# Altium schematic sheet DIGITAL_INPUTS.SchDoc
size A3; SheetNumber: 7; SheetTotal: 14
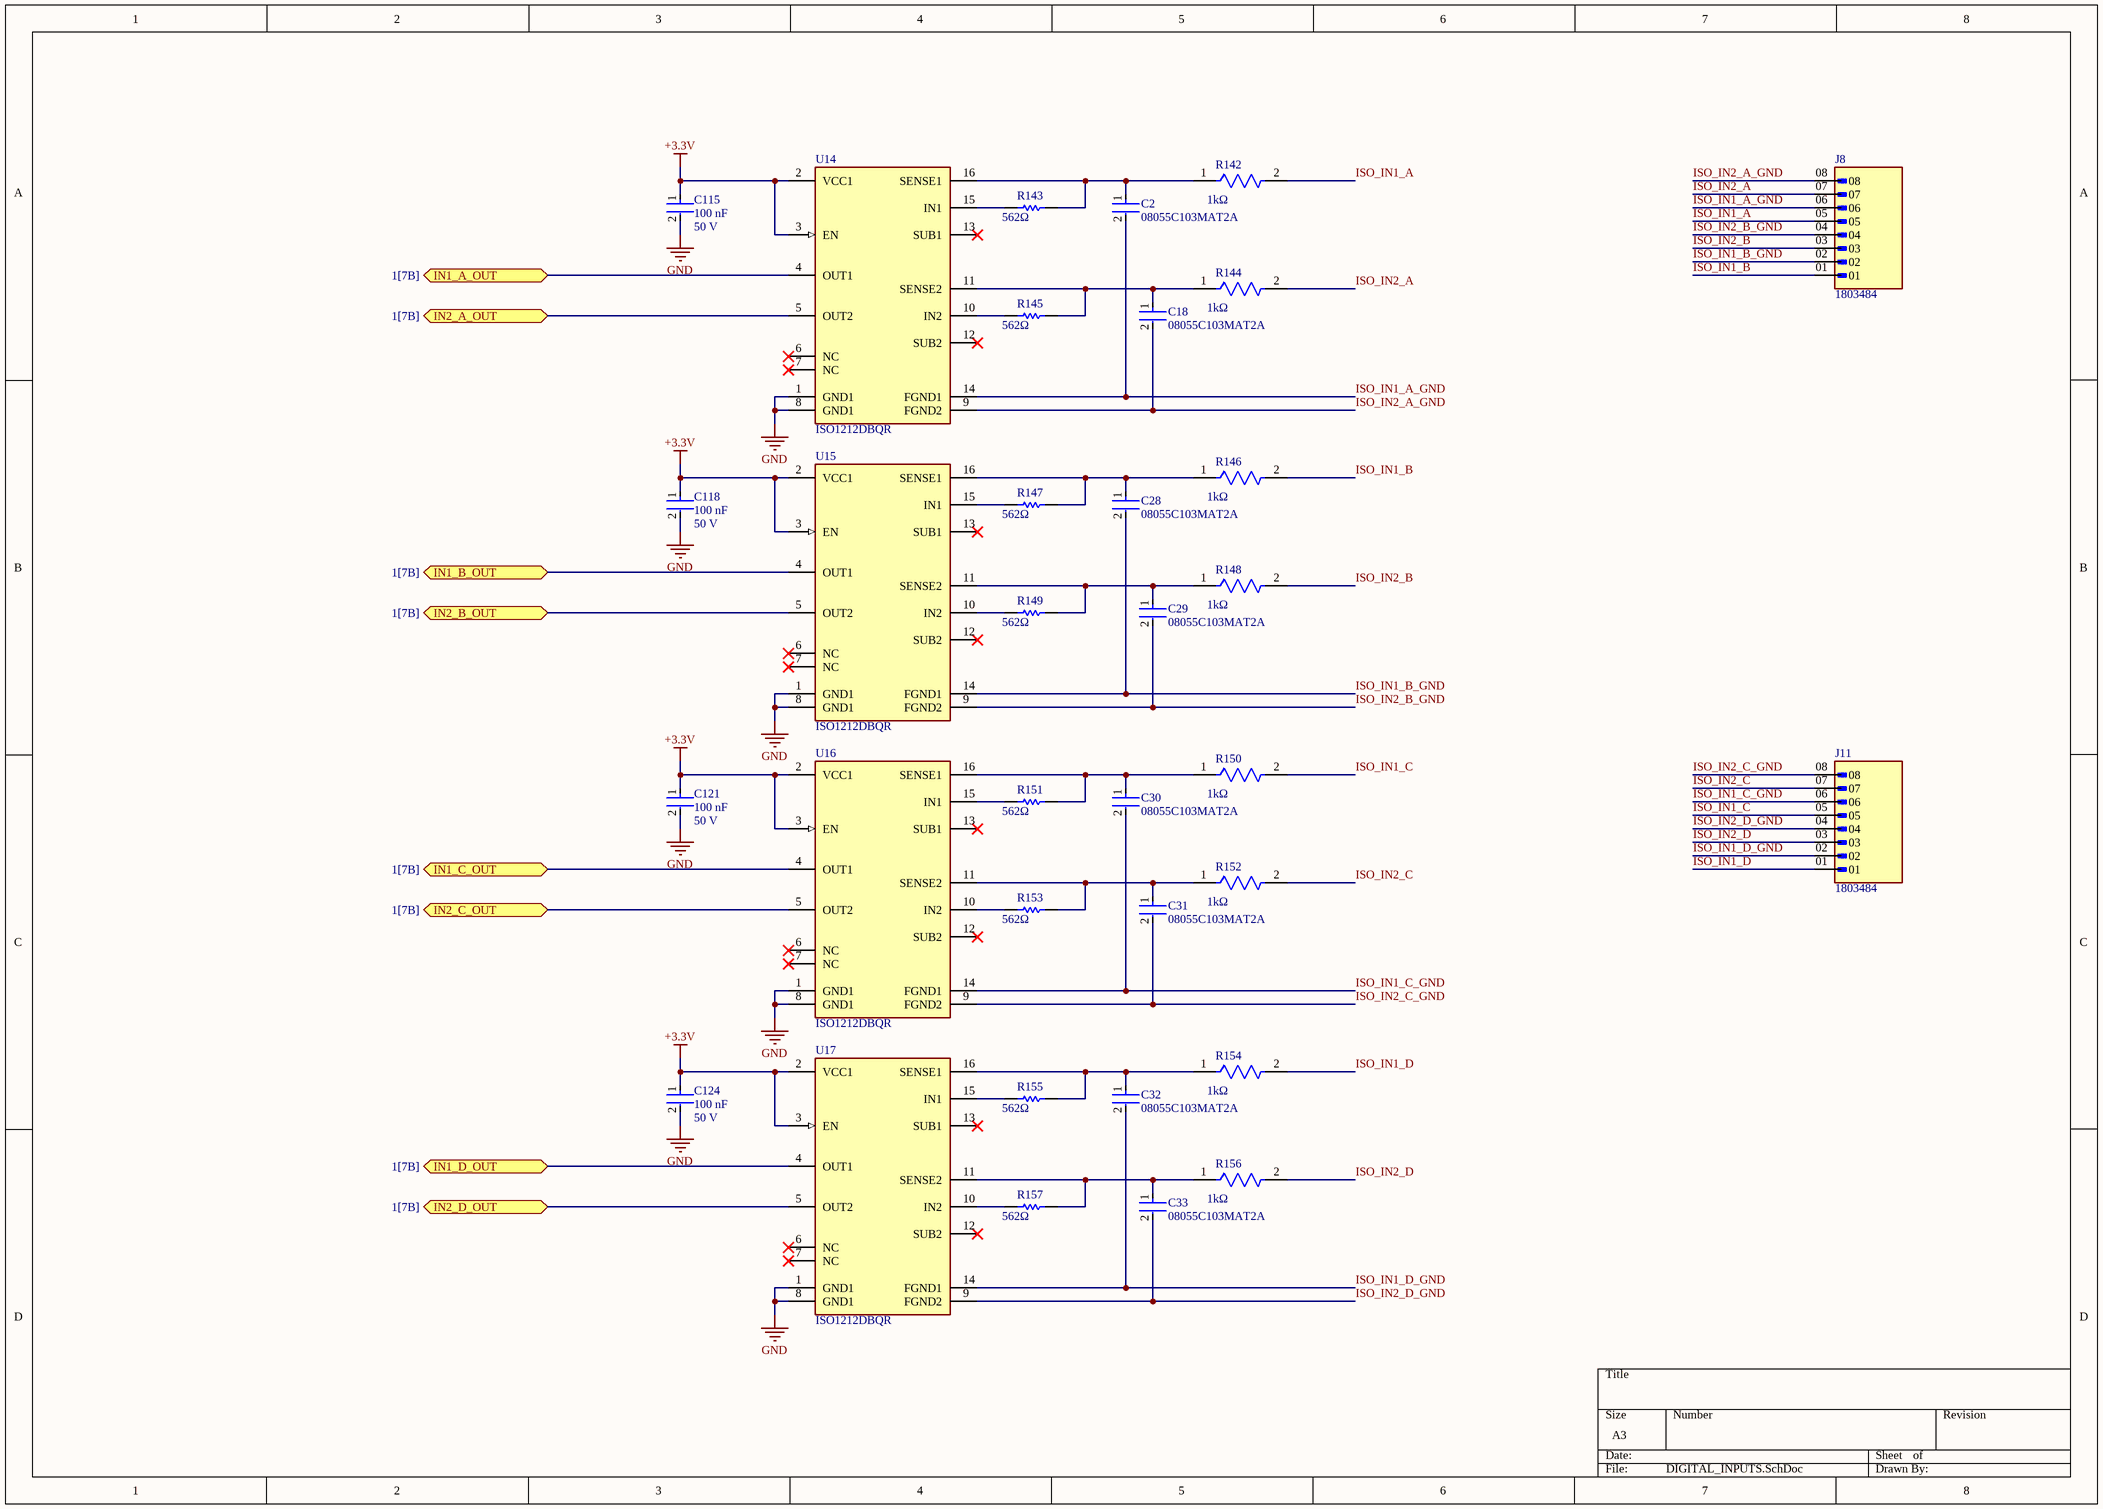
[diagram p0: DIGITAL_INPUTS.SchDoc]

## Parts
C2  08055C103MAT2A  [FP-0805-L_2_01_0_2-W_1_25-MFG]
C18  08055C103MAT2A  [FP-0805-L_2_01_0_2-W_1_25-MFG]
C28  08055C103MAT2A  [FP-0805-L_2_01_0_2-W_1_25-MFG]
C29  08055C103MAT2A  [FP-0805-L_2_01_0_2-W_1_25-MFG]
C30  08055C103MAT2A  [FP-0805-L_2_01_0_2-W_1_25-MFG]
C31  08055C103MAT2A  [FP-0805-L_2_01_0_2-W_1_25-MFG]
C32  08055C103MAT2A  [FP-0805-L_2_01_0_2-W_1_25-MFG]
C33  08055C103MAT2A  [FP-0805-L_2_01_0_2-W_1_25-MFG]
C115  value 100 nF  Voltage Rating: 50 V  [FP-C0603C-CF-IPC_B]  (hidden comment: C0603C104M5RACTU)
C118  value 100 nF  Voltage Rating: 50 V  [FP-C0603C-CF-IPC_B]  (hidden comment: C0603C104M5RACTU)
C121  value 100 nF  Voltage Rating: 50 V  [FP-C0603C-CF-IPC_B]  (hidden comment: C0603C104M5RACTU)
C124  value 100 nF  Voltage Rating: 50 V  [FP-C0603C-CF-IPC_B]  (hidden comment: C0603C104M5RACTU)
J8  1803484  [PHOENIX_1803484]
J11  1803484  [PHOENIX_1803484]
R142  Resistance: 1kΩ  [FP-AC0603-IPC_B]  (hidden comment: AC0603FR-071KL)
R143  Resistance: 562Ω  [RESC1608X55X25ML10T15]  (hidden comment: RC0603FR-07562RL)
R144  Resistance: 1kΩ  [FP-AC0603-IPC_B]  (hidden comment: AC0603FR-071KL)
R145  Resistance: 562Ω  [RESC1608X55X25ML10T15]  (hidden comment: RC0603FR-07562RL)
R146  Resistance: 1kΩ  [FP-AC0603-IPC_B]  (hidden comment: AC0603FR-071KL)
R147  Resistance: 562Ω  [RESC1608X55X25ML10T15]  (hidden comment: RC0603FR-07562RL)
R148  Resistance: 1kΩ  [FP-AC0603-IPC_B]  (hidden comment: AC0603FR-071KL)
R149  Resistance: 562Ω  [RESC1608X55X25ML10T15]  (hidden comment: RC0603FR-07562RL)
R150  Resistance: 1kΩ  [FP-AC0603-IPC_B]  (hidden comment: AC0603FR-071KL)
R151  Resistance: 562Ω  [RESC1608X55X25ML10T15]  (hidden comment: RC0603FR-07562RL)
R152  Resistance: 1kΩ  [FP-AC0603-IPC_B]  (hidden comment: AC0603FR-071KL)
R153  Resistance: 562Ω  [RESC1608X55X25ML10T15]  (hidden comment: RC0603FR-07562RL)
R154  Resistance: 1kΩ  [FP-AC0603-IPC_B]  (hidden comment: AC0603FR-071KL)
R155  Resistance: 562Ω  [RESC1608X55X25ML10T15]  (hidden comment: RC0603FR-07562RL)
R156  Resistance: 1kΩ  [FP-AC0603-IPC_B]  (hidden comment: AC0603FR-071KL)
R157  Resistance: 562Ω  [RESC1608X55X25ML10T15]  (hidden comment: RC0603FR-07562RL)
U14  ISO1212DBQR  [FP-DBQ0016A-MFG]
U15  ISO1212DBQR  [FP-DBQ0016A-MFG]
U16  ISO1212DBQR  [FP-DBQ0016A-MFG]
U17  ISO1212DBQR  [FP-DBQ0016A-MFG]

## Ports
IN1_A_OUT (bidir, see 1[7B]), IN1_B_OUT (bidir, see 1[7B]), IN1_C_OUT (bidir, see 1[7B]), IN1_D_OUT (bidir, see 1[7B]), IN2_A_OUT (bidir, see 1[7B]), IN2_B_OUT (bidir, see 1[7B]), IN2_C_OUT (bidir, see 1[7B]), IN2_D_OUT (bidir, see 1[7B])

## Nets
+3.3V: C115.1 C118.1 C121.1 C124.1 U14.2(VCC1) U14.3(EN) U15.2(VCC1) U15.3(EN) U16.2(VCC1) U16.3(EN) U17.2(VCC1) U17.3(EN)
GND: C115.2 C118.2 C121.2 C124.2 U14.1(GND1) U14.8(GND1) U15.1(GND1) U15.8(GND1) U16.1(GND1) U16.8(GND1) U17.1(GND1) U17.8(GND1)
IN1_A_OUT: U14.4(OUT1) ; port IN1_A_OUT
IN1_B_OUT: U15.4(OUT1) ; port IN1_B_OUT
IN1_C_OUT: U16.4(OUT1) ; port IN1_C_OUT
IN1_D_OUT: U17.4(OUT1) ; port IN1_D_OUT
IN2_A_OUT: U14.5(OUT2) ; port IN2_A_OUT
IN2_B_OUT: U15.5(OUT2) ; port IN2_B_OUT
IN2_C_OUT: U16.5(OUT2) ; port IN2_C_OUT
IN2_D_OUT: U17.5(OUT2) ; port IN2_D_OUT
ISO_IN1_A: J8.05 R142.2
ISO_IN1_A_GND: C2.2 J8.06 U14.14(FGND1)
ISO_IN1_B: J8.01 R146.2
ISO_IN1_B_GND: C28.2 J8.02 U15.14(FGND1)
ISO_IN1_C: J11.05 R150.2
ISO_IN1_C_GND: C30.2 J11.06 U16.14(FGND1)
ISO_IN1_D: J11.01 R154.2
ISO_IN1_D_GND: C32.2 J11.02 U17.14(FGND1)
ISO_IN2_A: J8.07 R144.2
ISO_IN2_A_GND: C18.2 J8.08 U14.9(FGND2)
ISO_IN2_B: J8.03 R148.2
ISO_IN2_B_GND: C29.2 J8.04 U15.9(FGND2)
ISO_IN2_C: J11.07 R152.2
ISO_IN2_C_GND: C31.2 J11.08 U16.9(FGND2)
ISO_IN2_D: J11.03 R156.2
ISO_IN2_D_GND: C33.2 J11.04 U17.9(FGND2)
NetC2_1: C2.1 R142.1 R143.2 U14.16(SENSE1)
NetC18_1: C18.1 R144.1 R145.2 U14.11(SENSE2)
NetC28_1: C28.1 R146.1 R147.2 U15.16(SENSE1)
NetC29_1: C29.1 R148.1 R149.2 U15.11(SENSE2)
NetC30_1: C30.1 R150.1 R151.2 U16.16(SENSE1)
NetC31_1: C31.1 R152.1 R153.2 U16.11(SENSE2)
NetC32_1: C32.1 R154.1 R155.2 U17.16(SENSE1)
NetC33_1: C33.1 R156.1 R157.2 U17.11(SENSE2)
NetR143_1: R143.1 U14.15(IN1)
NetR145_1: R145.1 U14.10(IN2)
NetR147_1: R147.1 U15.15(IN1)
NetR149_1: R149.1 U15.10(IN2)
NetR151_1: R151.1 U16.15(IN1)
NetR153_1: R153.1 U16.10(IN2)
NetR155_1: R155.1 U17.15(IN1)
NetR157_1: R157.1 U17.10(IN2)

Not connected (* = marked no-connect by the designer): U14 6(NC)* 7(NC)* 12(SUB2)* 13(SUB1)*; U15 6(NC)* 7(NC)* 12(SUB2)* 13(SUB1)*; U16 6(NC)* 7(NC)* 12(SUB2)* 13(SUB1)*; U17 6(NC)* 7(NC)* 12(SUB2)* 13(SUB1)*

## Library data of the parts
C2 C18 C28-C33 = CMP-2007-04366-2: General Purpose Ceramic Capacitor, 0805, 10nF, 20%, X7R, 0.15, 50V; Insulation Resistance: 100GR; Dissipation Factor: 2.5%; Mount: Surface Mount; Packaging: Tape and Reel; Max Operating Temperature: 125°C; Series: -; Voltage Rating: 50V; Contact Plating: Tin; Case Code (Metric): 2012; Depth: 1.25mm; Case/Package: 0805; Min Operating Temperature: -55°C; Termination: SMD/SMT; RoHS Compliant: Yes; Height: 0.94mm; Construction: Flat; Voltage: 50V; REACH SVHC: No SVHC; Dielectric: X7R; Voltage Rating (DC): 50V; Case Code (Imperial): 0805; Capacitance: 10nF; Lead Free: Lead Free; Thickness: 0.037inch; Package Quantity: 1; Radiation Hardening: No; Number of Pins: 2; Width: 0.049inch; Dielectric Material: Ceramic; Tolerance: 20%; Length: 2.01mm
C115 C118 C121 C124 = CMP-2006-03068-2: CAP CER 0.1UF 50V 20% X7R 0603; Manufacturer: KEMET; Material: Ceramic; Tolerance: 0.2; Temperature Coefficient: 30ppm/°C; Automotive Grade: Grade 1; Capacitance: 0.10 μF; Temperature Range High: +125°C; Device Class L3: Ceramic Capacitors; Manufacturer Part Number: C0603C104M5RACTU; Height: 0.87mm; Category: Cap; RoHS: TRUE; Digikey Description: CAP CER 0.1UF 50V 20% X7R 0603; ComponentLink2URL: https://api.kemet.com/component-edge/download/datasheet/C0603C100J5GACAUTO.pdf; Lead Free: Yes; Temperature Range Low: -55°C; Device Class L1: Passive Components; ComponentLink2Description: Datasheet; Temperature Characteristic: X7R; Automotive: Yes; Temperature: -55°C to +125°C; Octopart: https://octopart.com/c0603c104m5ractu-kemet-11855687; Device Class L2: Capacitors; Package: C0603C-CF; Mouser Description: Multilayer Ceramic Capacitors MLCC - SMD/SMT 50volts 0.1uF X7R 20%
J8 J11 = 1803484: MF: {'manufacturer': u'Phoenix Contact'}; Package: None; Price: None; Value: *; MP: 1803484; Availability: Unavailable
R142 R144 R146 R148 R150 R152 R154 R156 = CMP-2000-04828-3: RES 1kΩ 1.00% 0.1W 0603; Voltage Rating: 50V; Power Rating: 100mW; Tolerance: 1%; Temperature Coefficient: 100ppm/°C; Depth: 0.8mm; Case/Package: 0603; Size Code: 0603; Case Code (Metric): 1608; Height: 0.022inch; Series: AC; Width: 0.031inch; Construction: Rectangular; Length: 0.063inch; Case Code (Imperial): 0603; Package Quantity: 1; RoHS Compliant: Yes; Features: Moisture Resistant; Resistor Type: Thick Film; Max Power Dissipation: 100mW; Packaging: Tape and Reel; Termination: SMD/SMT; Ratings: AEC-Q200; Max Operating Temperature: 155°C; Min Operating Temperature: -55°C; Military Standard: Not; Lead Free: Lead Free; Number of Terminations: 2
R143 R145 R147 R149 R151 R153 R155 R157 = CMP-2000-04085-1: Manufacturer: Yageo; Part Number: RC0603FR-07562RL
U14-U17 = CMP-04872-000004-1: ISOLATED 24-V TO 60-V DIGITAL IN; Manufacturer: Texas Instruments; Standoff Height: 0.11mm; Max Supply Voltage: 5.5V; Min Supply Voltage: 2.25V; Nominal Supply Current: 194-389mA; Max Junction Temp: +150°C; ComponentLink2URL: http://www.ti.com/lit/ds/symlink/iso1212.pdf; Device Class L1: Integrated Circuits (ICs); Octopart: https://octopart.com/iso1212dbqr-texas+instruments-84619664; Ipc Land Pattern Name: SOP64P600X175-16; Ambient Temperature Range High: +125°C; Automotive: No; Temperature Range High: +125°C; Manufacturer Part Number: ISO1212DBQR; Package: DBQ0016A; Lead Free: Yes; RoHS: TRUE; Device Class L3: unset; Digikey Description: ISOLATED 24-V TO 60-V DIGITAL IN; ComponentLink2Description: Datasheet; Height: 1.75mm; Device Class L2: Interface ICs; Temperature Range Low: -55°C; Ambient Temperature Range Low: -40°C; Category: IC; Temperature: -55°C to +125°C